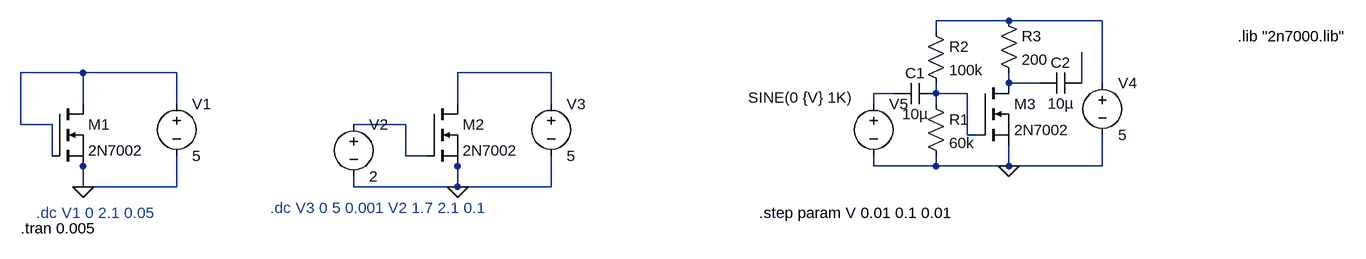
[diagram p0: schematic Lab3.asc]
Lab3.asc, the LTspice schematic file:
Version 4
SHEET 1 3384 916
WIRE 1520 16 1408 16
WIRE 1664 16 1520 16
WIRE 1408 32 1408 16
WIRE 96 96 0 96
WIRE 240 96 96 96
WIRE 816 96 672 96
WIRE 1520 112 1520 96
WIRE 1568 112 1520 112
WIRE 1632 112 1632 64
WIRE 1664 112 1664 16
WIRE 1344 128 1312 128
WIRE 1408 128 1408 112
WIRE 1456 128 1408 128
WIRE 96 144 96 96
WIRE 240 144 240 96
WIRE 672 144 672 96
WIRE 816 144 816 96
WIRE 1312 144 1312 128
WIRE 1408 144 1408 128
WIRE 0 176 0 96
WIRE 48 176 0 176
WIRE 592 176 512 176
WIRE 1456 192 1456 128
WIRE 1472 192 1456 192
WIRE 48 224 48 176
WIRE 592 224 592 176
WIRE 624 224 592 224
WIRE 96 240 96 224
WIRE 672 240 672 224
WIRE 1312 240 1312 224
WIRE 1408 240 1408 224
WIRE 1408 240 1312 240
WIRE 1520 240 1520 208
WIRE 1520 240 1408 240
WIRE 1664 240 1664 192
WIRE 1664 240 1520 240
WIRE 96 272 96 240
WIRE 240 272 240 224
WIRE 240 272 96 272
WIRE 512 272 512 256
WIRE 672 272 672 240
WIRE 672 272 512 272
WIRE 816 272 816 224
WIRE 816 272 672 272
FLAG 96 272 0
FLAG 672 272 0
FLAG 1520 240 0
SYMBOL voltage 240 128 R0
WINDOW 123 0 0 Left 0
WINDOW 39 0 0 Left 0
SYMATTR InstName V1
SYMATTR Value 5
SYMBOL nmos 48 144 R0
SYMATTR InstName M1
SYMATTR Value 2N7002
SYMBOL voltage 816 128 R0
WINDOW 123 0 0 Left 0
WINDOW 39 0 0 Left 0
SYMATTR InstName V3
SYMATTR Value 5
SYMBOL nmos 624 144 R0
SYMATTR InstName M2
SYMATTR Value 2N7002
SYMBOL voltage 512 160 R0
WINDOW 123 0 0 Left 0
WINDOW 39 0 0 Left 0
SYMATTR InstName V2
SYMATTR Value 2
SYMBOL voltage 1664 96 R0
WINDOW 123 0 0 Left 0
WINDOW 39 0 0 Left 0
SYMATTR InstName V4
SYMATTR Value 5
SYMBOL res 1392 128 R0
SYMATTR InstName R1
SYMATTR Value 60k
SYMBOL res 1392 16 R0
SYMATTR InstName R2
SYMATTR Value 100k
SYMBOL res 1504 0 R0
SYMATTR InstName R3
SYMATTR Value 200
SYMBOL cap 1632 96 R90
WINDOW 0 0 32 VBottom 2
WINDOW 3 32 32 VTop 2
SYMATTR InstName C2
SYMATTR Value 10µ
SYMBOL voltage 1312 128 R0
WINDOW 3 -193 6 Left 2
WINDOW 123 0 0 Left 0
WINDOW 39 0 0 Left 0
SYMATTR Value SINE(0 {V} 1K)
SYMATTR InstName V5
SYMBOL cap 1408 112 R90
WINDOW 0 0 32 VBottom 2
WINDOW 3 32 32 VTop 2
SYMATTR InstName C1
SYMATTR Value 10µ
SYMBOL nmos 1472 112 R0
SYMATTR InstName M3
SYMATTR Value 2N7002
TEXT 24 312 Left 2 ;.dc V1 0 2.1 0.05
TEXT 384 304 Left 2 ;.dc V3 0 5 0.001 V2 1.7 2.1 0.1
TEXT 0 336 Left 2 !.tran 0.005
TEXT 1136 312 Left 2 !.step param V 0.01 0.1 0.01
TEXT 1872 40 Left 2 !.lib "2n7000.lib"

The netlist it stands for:
* Lab3.asc
V1 N002 0 5
M1 N002 N002 0 0 2N7002
V3 N003 0 5
M2 N003 N008 0 0 2N7002
V2 N008 0 2
V4 N001 0 5
R1 N007 0 60k
R2 N001 N007 100k
R3 N001 N004 200
C2 N005 N004 10µ
V5 N006 0 SINE(0 {V} 1K)
C1 N007 N006 10µ
M3 N004 N007 0 0 2N7002
.model NMOS NMOS
.model PMOS PMOS
.lib standard.mos
* .dc V1 0 2.1 0.05
* .dc V3 0 5 0.001 V2 1.7 2.1 0.1
.tran 0.005
.step param V 0.01 0.1 0.01
.lib "2n7000.lib"
.backanno
.end